# EAGLE design Qwiic_RFID_Tag_X01 (EAGLE 9.6.2)
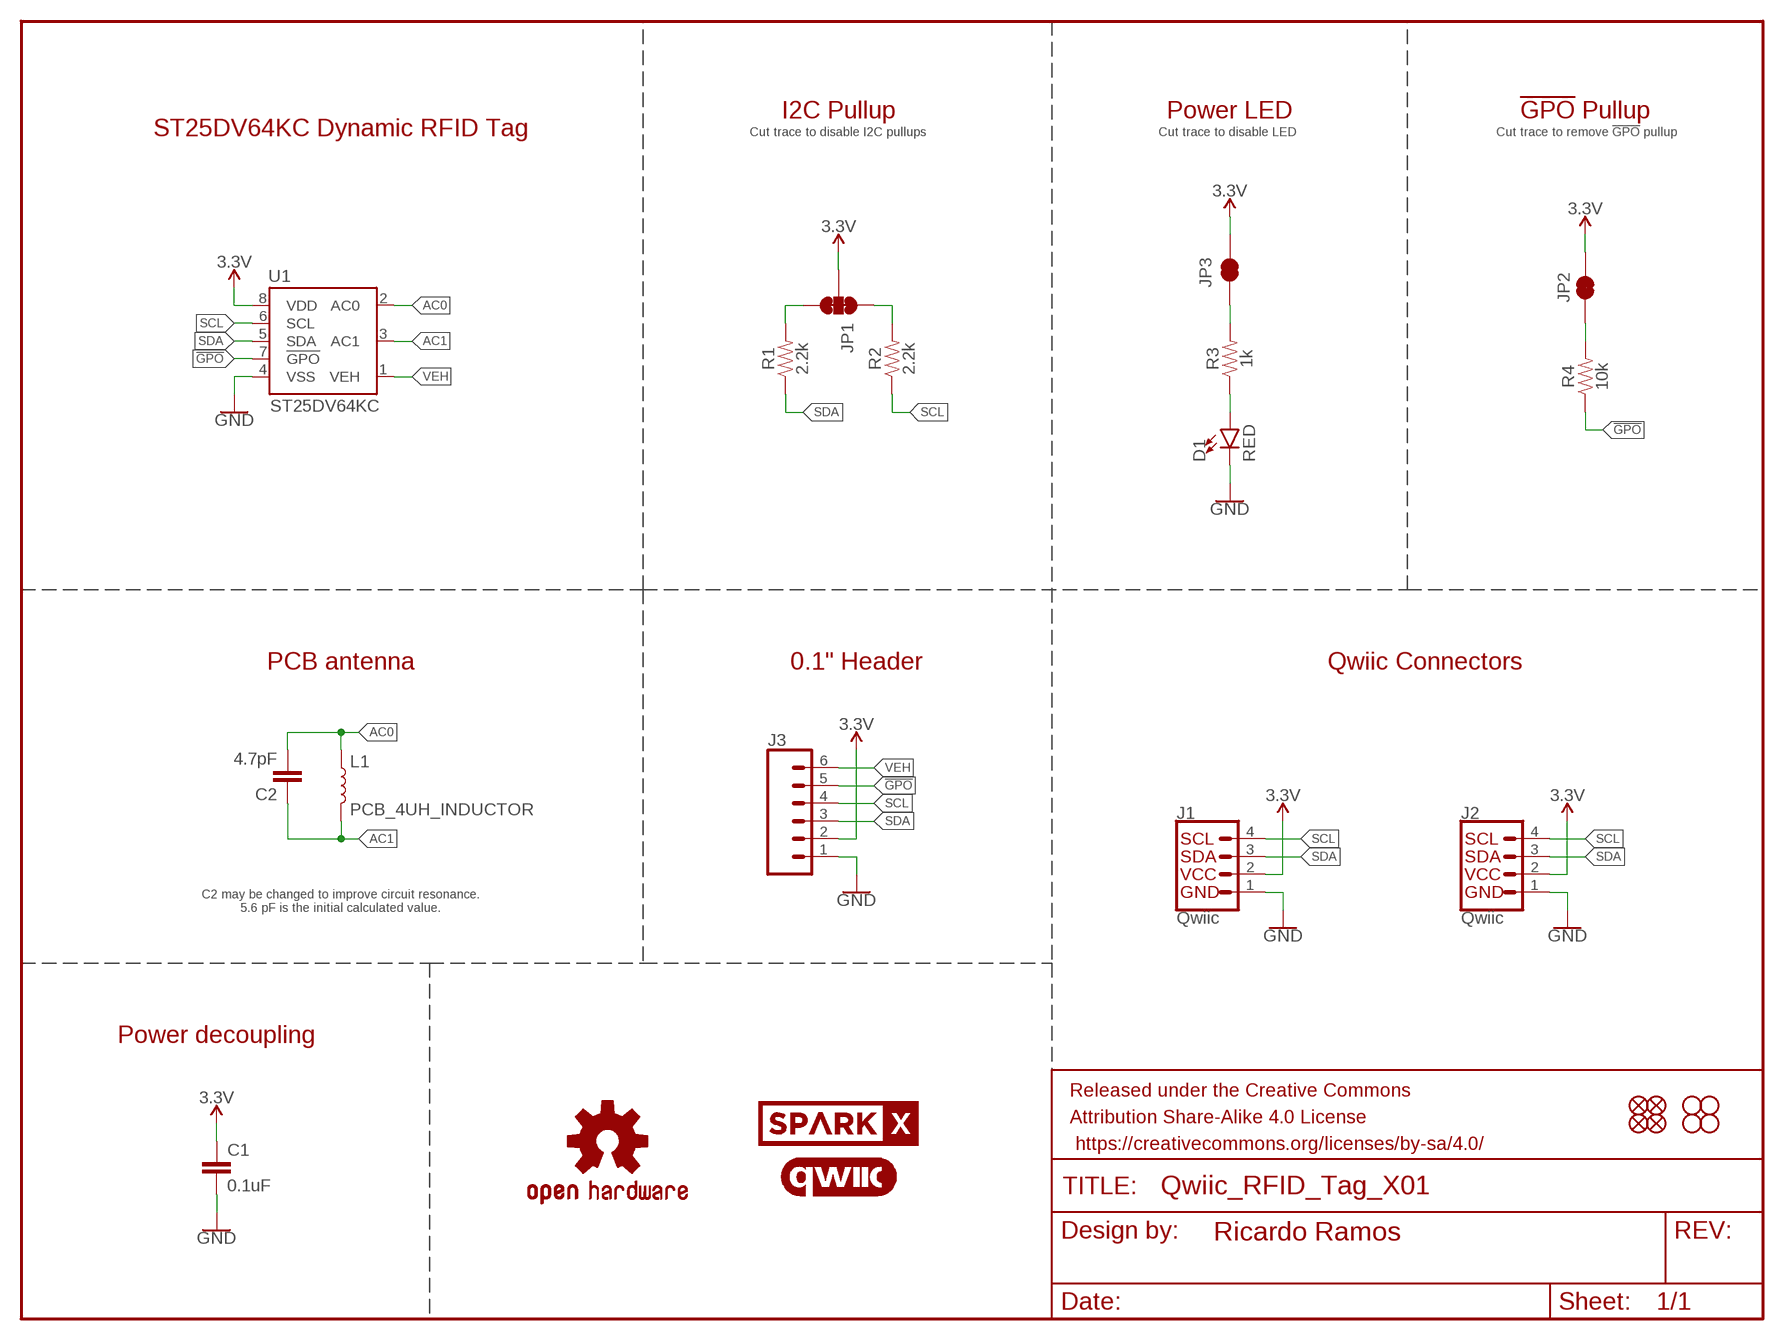
[diagram p0: schematic, sheet 1]

## Parts
C1  0.1uF  0.1UF-0603-25V-(+80/-20%)  [0603]
C2  4.7pF  4.7PF-0603-50V-5%  [0603]
D1  RED  LED-RED0603  [LED-0603]
FD1  FIDUCIAL1X2  [FIDUCIAL-1X2]
FD2  FIDUCIAL1X2  [FIDUCIAL-1X2]
FD3  FIDUCIAL1X2  [FIDUCIAL-1X2]
FD4  FIDUCIAL1X2  [FIDUCIAL-1X2]
FRAME1  FRAME-LETTERNO_PACKAGE  [DUMMY]
H1  STAND-OFF  [STAND-OFF]
H2  STAND-OFF  [STAND-OFF]
H3  STAND-OFF  [STAND-OFF]
H4  STAND-OFF  [STAND-OFF]
J1  Qwiic  QWIIC_CONNECTORJS-1MM  [JST04_1MM_RA]
J2  Qwiic  QWIIC_CONNECTORJS-1MM  [JST04_1MM_RA]
J3  CONN_06NO_SILK_FEMALE_PTH  [1X06_NO_SILK]
JP1  JUMPER-SMT_3_2-NC_TRACE_SILK  [SMT-JUMPER_3_2-NC_TRACE_SILK]
JP2  JUMPER-SMT_2_NC_TRACE_SILK  [SMT-JUMPER_2_NC_TRACE_SILK]
JP3  JUMPER-SMT_2_NC_TRACE_SILK  [SMT-JUMPER_2_NC_TRACE_SILK]
L1  PCB_4UH_INDUCTOR  [PCB_4UH_INDUCTOR]
LOGO1  OSHW-LOGOMINI  [OSHW-LOGO-MINI]
LOGO2  QWIIC_LOGO_7MM  [QWIIC_7MM]
LOGO3  QWIIC_LOGO_7MM  [QWIIC_7MM]
R1  2.2k  2.2KOHM-0603-1/10W-1%  [0603]
R2  2.2k  2.2KOHM-0603-1/10W-1%  [0603]
R3  1k  1KOHM-0603-1/10W-1%  [0603]
R4  10k  10KOHM-0603-1/10W-1%  [0603]
U1  ST25DV64KC  [SO08]
U$1  SPARKX-LOGO5  [SPARKX-LARGE]
U$2  SPARKX-LOGO5  [SPARKX-LARGE]

## Nets
3.3V: C1.1 J1.2 J2.2 J3.2 JP1.2 JP2.2 JP3.2 U1.8(VDD)
!GPO!: J3.5 R4.1 U1.7(!GPO!)
AC0: C2.2 L1.IN1 U1.2(AC0)
AC1: C2.1 L1.IN2 U1.3(AC1)
GND: C1.2 D1.C J1.1 J2.1 J3.1 U1.4(VSS)
N$1: JP3.1 R3.2
N$2: JP1.3 R1.2
N$3: JP1.1 R2.2
N$4: D1.A R3.1
N$5: JP2.1 R4.2
SCL: J1.4 J2.4 J3.4 R2.1 U1.6(SCL)
SDA: J1.3 J2.3 J3.3 R1.1 U1.5(SDA)
VEH: J3.6 U1.1(VEH)

## Notes on the sheet
- I2C Pullup | Power LED | !GPO! Pullup
- ST25DV64KC Dynamic RFID Tag
- Cut trace to disable I2C pullups | Cut trace to disable LED | Cut trace to remove !GPO! pullup
- PCB antenna | 0.1" Header | Qwiic Connectors
- C2 may be changed to improve circuit resonance.
  5.6 pF is the initial calculated value.
- Power decoupling

## Library data of the parts
C1 = SparkFun-Capacitors:0.1UF: 0.1µF ceramic capacitors A capacitor is a passive two-terminal electrical component used to store electrical energy temporarily in an electric field.; PROD_ID: CAP-00810
C2 = SparkFun-Capacitors:4.7PF: 4.7pF ceramic capacitors A capacitor is a passive two-terminal electrical component used to store electrical energy temporarily in an electric field.; PROD_ID: CAP-07880
D1 = SparkFun-LED:LED-RED: Red SMD LED Used in manufacturing of most products at SparkFun Packages: 0603 - SMD 0603 package [Product Link] <http://docs.avagotech.com/docs/AV02-0551EN> 0603 SMART - SMD 0603 SMART package ( more efficient and expensive)[Product Link] <http://www.osram-os.com/Graphics/XPic2/00077099_0.pdf> 1206 - SMD1206 package [Product Link] <https://www.sparkfun.com/datasheets/DevTools/LilyPad/Q150OVS4.pdff> SparkFun Products: Pro Mini 328 -5V <https://www.sparkfun.com/products/821> RedBoard <https://www.sparkfun.com/products/12757> IOIO-OTG <https://www.sparkfun.com/products/13613>; PROD_ID: DIO-00819
FD1-FD4 = SparkFun-Aesthetics:FIDUCIAL: Fiducial Alignment Points Point-of-reference for pick-and-place machines and other optical instruments.
FRAME1 = SparkFun-Aesthetics:FRAME-LETTER: Schematic Frame - Letter Standard 8.5x11 US Letter frame; DESIGNER: Ricardo Ramos; VERSION: v01
H1-H4 = SparkFun-Hardware:STAND-OFF: Stand Off Drill holes for mechanically mounting via screws, standoffs, etc. Note: Use the keepout ring to avoid running the screw head into surrounding components. Variant Overviews STAND-OFF - Mechanical footprint for a #4 phillips button head screw. STAND-OFF-TIGHT - Mechanical footprint for a #4 phillips button head screw, Example SparkFun Products Screw - Phillips Head (1/4", 4-40, 10 pack) <https://www.sparkfun.com/products/10453> (PRT-10453) Screw - Phillips Head (1/2", 4-40, 10 pack) <https://www.sparkfun.com/products/10452> (PRT-10452) Screw - Phillips Head (3/4", 4-40, 10 pack) <https://www.sparkfun.com/products/10451> (PRT-10451) Screw - Phillips Head (1", 4-40, 10 pack) <https://www.sparkfun.com/products/10450> (PRT-10450)
J1 J2 = SparkFun-Connectors:QWIIC_CONNECTOR: SparkFun I2C Standard Qwiic Connector An SMD 1mm pitch JST connector makes it easy and quick (get it? Qwiic?) to connect I2C devices to each other. The Qwiic system <http://www.sparkfun.com/qwiic> enables fast and solderless connection between popular platforms and various sensors and actuators. We carry 200mm <https://www.sparkfun.com/products/14204>, 100mm <https://www.sparkfun.com/products/14205>, 50mm <https://www.sparkfun.com/products/14206>, and breadboard friendly <https://www.sparkfun.com/products/14207> Qwiic cables. We also offer 10 pcs strips <https://www.sparkfun.com/products/14323> the SMD connectors.; PROD_ID: CONN-13694; VALUE: QWIIC_RIGHT_ANGLE
J3 = SparkFun-Connectors:CONN_06: Multi connection point. Often used as Generic Header-pin footprint for 0.1 inch spaced/style header connections On any of the 0.1 inch spaced packages, you can populate with these: Break Away Headers - Straight <https://www.sparkfun.com/products/116> (PRT-00116) Break Away Male Headers - Right Angle <https://www.sparkfun.com/products/553> (PRT-00553) Female Headers <https://www.sparkfun.com/products/115> (PRT-00115) Break Away Headers - Machine Pin <https://www.sparkfun.com/products/117> (PRT-00117) Break Away Female Headers - Swiss Machine Pin <https://www.sparkfun.com/products/743> (PRT-00743) Arduino Stackable Header - 6 Pin <https://www.sparkfun.com/products/9280> (PRT-09280) For SCREWTERMINALS and SPRING TERMINALS visit here: Screw Terimnals on SparkFun.com <https://www.sparkfun.com/search/results?term=Screw+Terminals> (5mm/3.5mm/2.54mm spacing) This device is also useful as a general connection point to wire up your design to another part of your project. Our various solder wires solder well into these plated through hole pads. Hook-Up Wire - Assortment (Stranded, 22 AWG) <https://www.sparkfun.com/products/11375> (PRT-11375) Hook-Up Wire - Assortment (Solid Core, 22 AWG) <https://www.sparkfun.com/products/11367> (PRT-11367) View the entire wire category on our website here <https://www.sparkfun.com/categories/141>; PROD_ID: CONN-08437
JP1 = SparkFun-Jumpers:JUMPER-SMT_3_2-NC_TRACE: Normally closed trace jumper (2 of 2 connections) This jumper has a trace between all three pads so they are normally closed (NC). Use a razor knife to open the connection(s). For best results follow the IPC guidelines for cutting traces: Cutout at least 0.063 mm (0.005 in). Remove all loose material to clean up the cut area. Seal the cut with an approved epoxy. Reapply solder to reclose the connection(s).
JP2 JP3 = SparkFun-Jumpers:JUMPER-SMT_2_NC_TRACE: Normally closed trace jumper This jumper has a trace between two pads so it's normally closed (NC). Use a razor knife to open the connection. For best results follow the IPC guidelines for cutting traces: Cutout at least 0.063 mm (0.005 in). Remove all loose material to clean up the cut area. Seal the cut with an approved epoxy. Reapply solder to reclose the connection.
L1 = SparkFun-Coils:PCB_4UH_INDUCTOR
LOGO1 = SparkFun-Aesthetics:OSHW-LOGO: Open-Source Hardware (OSHW) Logo This logo indicates the piece of hardware it is found on incorporates a OSHW license and/or adheres to the definition of open source hardware found here: http://freedomdefined.org/OSHW
LOGO2 LOGO3 = SparkFun-Aesthetics:QWIIC_LOGO: Qwiic Logos for placement on schematic and PCB. The 5.5mm silk logo is best for placing next to Qwiic connector.
R1 R2 = SparkFun-Resistors:2.2KOHM: 2.2kΩ resistor A resistor is a passive two-terminal electrical component that implements electrical resistance as a circuit element. Resistors act to reduce current flow, and, at the same time, act to lower voltage levels within circuits. - Wikipedia; PROD_ID: RES-08272
R3 = SparkFun-Resistors:1KOHM: 1kΩ resistor A resistor is a passive two-terminal electrical component that implements electrical resistance as a circuit element. Resistors act to reduce current flow, and, at the same time, act to lower voltage levels within circuits. - Wikipedia; PROD_ID: RES-07856
R4 = SparkFun-Resistors:10KOHM: 10kΩ resistor A resistor is a passive two-terminal electrical component that implements electrical resistance as a circuit element. Resistors act to reduce current flow, and, at the same time, act to lower voltage levels within circuits. - Wikipedia; PROD_ID: RES-00824
U1 = SparkFun-RF:ST25DV64KC: Dynamic NFC/RFID Dynamic NFC/RFID tag IC with 4-Kbit, 16-Kbit or 64-Kbit EEPROM, fast transfer mode capability and optimized I2C.; PROD_ID: IC-16315
U$1 U$2 = SparkX:SPARKX-LOGO

## Board
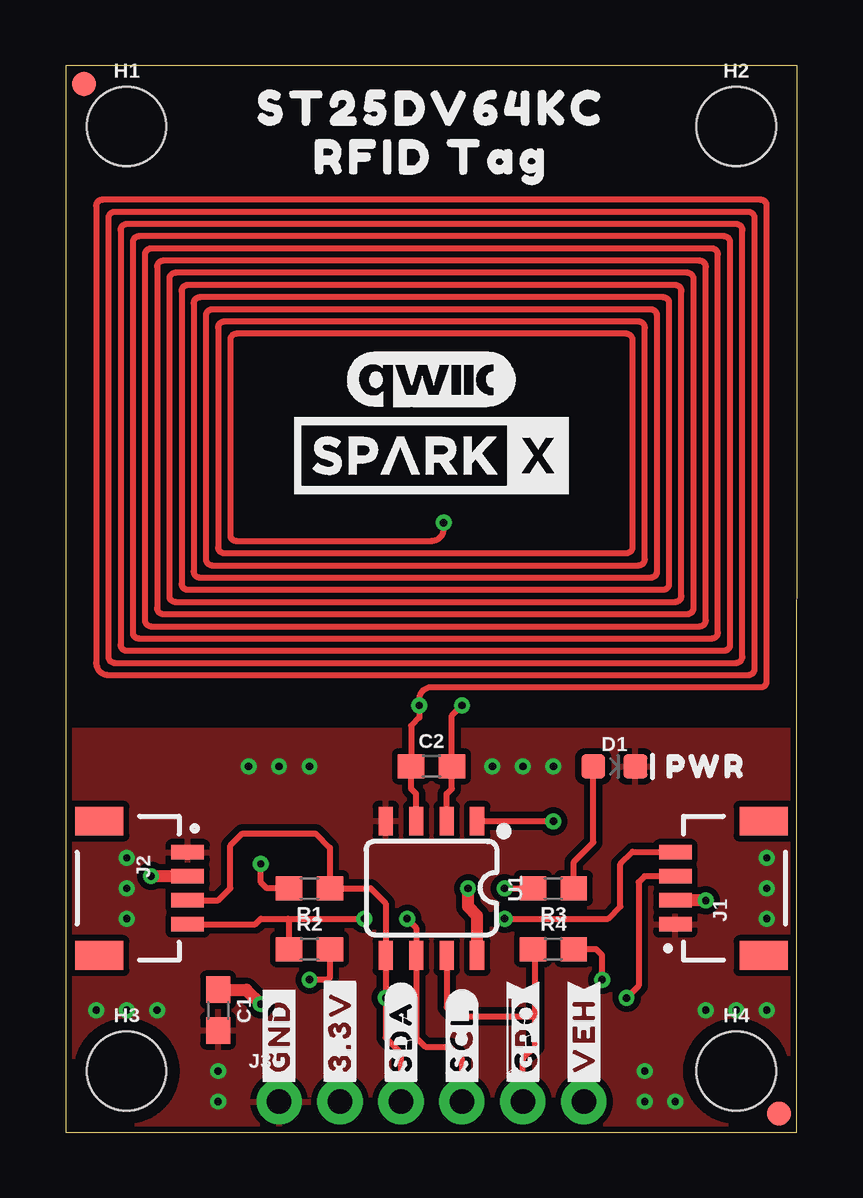
[diagram p1: board, top side]
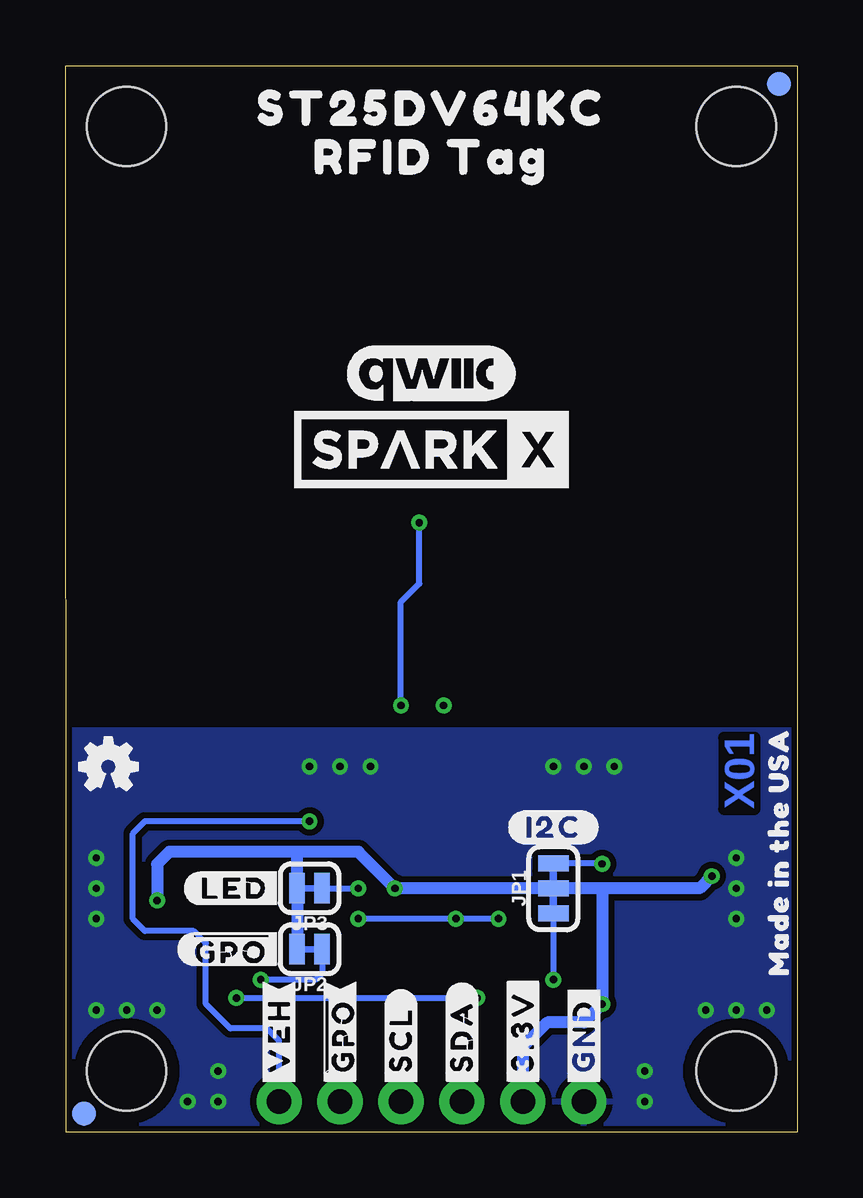
[diagram p2: board, bottom side, seen from below]

Size 30.48 x 44.45 mm. Coordinates in mm from the lower left corner, seen from the top.
Outline: 0,0 30.46,0 30.48,44.45 0,44.45 0,0
Copper layers (1*16): Top 0.035mm / dielectric 1.5mm / Bottom 0.035mm
Design rules "SparkFun-2-Layer-General-JLCPCB": minimum track width 7mil, minimum drill 0.3mm, track to track 7mil, track to pad 7mil, pad to pad 7mil, via to via 7mil, smd to smd 7mil, copper to edge 7mil, drill to drill 7mil, minimum pad ring 7mil, minimum via ring 7mil, stop-mask expansion 4mil, vias tented up to drill 25mil, thermal gap 10mil

### Footprints (pad centres in the part's own frame; a part is rotated, then mirrored left to right if it is on the bottom)
0603 = smd 1.1 x 1: 1 -0.85,0; 2 0.85,0
LED-0603 = smd 1 x 1: A -0.877,0; C 0.877,0
FIDUCIAL-1X2 = smd 1 x 1: 1 0,0
STAND-OFF = hole 3.302: 0,0
JST04_1MM_RA = smd 0.6 x 1.35: 1 -1.5,0; 2 -0.5,0; 3 0.5,0; 4 1.5,0 | smd 1.2 x 2: NC1 2.8,-3.675; NC2 -2.8,-3.675
1X06_NO_SILK = drill 1.016 pad 1.88: 1 0,0; 2 2.54,0; 3 5.08,0; 4 7.62,0; 5 10.16,0; 6 12.7,0
SMT-JUMPER_3_2-NC_TRACE_SILK = smd 0.66 x 1.27: 1 -1.041,0; 2 0,0; 3 1.041,0
SMT-JUMPER_2_NC_TRACE_SILK = smd 0.66 x 1.27: 1 -0.521,0; 2 0.521,0
PCB_4UH_INDUCTOR = drill 0.305 pad 0.61: IN1 0.508,7.62; IN2 -0.508,0
SO08 = smd 0.6 x 1.2: 1 -1.905,-2.8; 2 -0.635,-2.8; 3 0.635,-2.8; 4 1.905,-2.8; 5 1.905,2.8; 6 0.635,2.8; 7 -0.635,2.8; 8 -1.905,2.8

### Placement (x,y rotation side)
C1  6.35,5.08 270 top
C2  15.24,15.24 0 top
D1  22.86,15.24 0 top
FD1  0.76,43.69 0 bottom
FD2  0.76,43.69 0 top
FD3  29.72,0.76 0 bottom
FD4  29.72,0.76 0 top
FRAME1  0,0 0 top
H1  2.54,41.91 0 top
H2  27.94,41.91 0 top
H3  2.54,2.54 0 top
H4  27.94,2.54 0 top
J1  25.4,10.16 90 top
J2  5.08,10.16 270 top
J3  8.89,1.27 0 top
JP1  10.16,10.16 90 bottom
JP2  20.32,7.62 180 bottom
JP3  20.32,10.16 180 bottom
L1  15.24,17.78 0 top
LOGO1  28.7,15.24 0 bottom
LOGO2  15.24,31.62 0 bottom
LOGO3  15.24,31.37 0 top
R1  10.16,10.16 180 top
R2  10.16,7.62 0 top
R3  20.32,10.16 180 top
R4  20.32,7.62 0 top
U1  15.24,10.16 180 top
U$1  15.24,28.19 0 top
U$2  15.24,28.45 0 bottom
U$3  [#3#3V#0]  11.43,1.78 90 top
U$4  [#GND#4]  8.89,1.78 90 top
U$5  [#SDA#5]  13.97,1.78 90 top
U$6  [#SCL#6]  16.51,1.78 90 top
U$7  [##GPO##8]  19.05,1.78 90 top
U$8  [#VEH#7]  21.59,1.78 90 top
U$9  [PWR11]  26.67,15.24 0 top
U$11  [RFID_TAG13]  15.24,40.64 0 top
U$12  [RFID_TAG13]  15.24,40.64 0 bottom
U$13  [ST25DV64KC5984]  15.24,42.67 0 top
U$15  [#I2C#11]  10.16,12.7 0 bottom
U$16  [##GPO##9]  21.34,7.62 0 bottom
U$17  [#LED#10]  21.34,10.16 0 bottom
U$18  [#GND#4]  8.89,1.78 90 bottom
U$19  [#3#3V#0]  11.43,1.78 90 bottom
U$20  [#SDA#5]  13.97,1.78 90 bottom
U$21  [#SCL#6]  16.51,1.78 90 bottom
U$22  [##GPO##8]  19.05,1.78 90 bottom
U$23  [#VEH#7]  21.59,1.78 90 bottom
U$24  [ST25DV64KC5984]  15.24,42.67 0 bottom
U$34  [MADE_IN_THE_USA20]  0.76,11.68 90 bottom

### Tracks (layer width: path | path; a pad name or v marks a point on that pad's centre or on a via)
3.3V  (via drill 0.3)
  Top 0.508: J2.2 v3.56,10.66 v3.56,10.67 | v26.67,9.65 J1.2 | U1.8 17.14,9.02 16.76,9.4 v16.76,10.16 | C1.1 7.53,5.93 v8.13,5.33
  Bottom 0.508: v3.56,10.67 4.06,10.16 8.13,10.16 | 8.13,10.16 JP1.2 v16.76,10.16 18.29,11.68 20.83,11.68 | 20.83,11.68 26.16,11.68 26.67,11.18 v26.67,9.65 | 20.83,11.68 20.83,10.17 JP3.2 JP2.2 | 8.13,10.16 v8.13,5.33 8.89,4.57 10.41,4.57 11.43,3.56 J3.2
!GPO!
  Top 0.254: U1.7 15.88,5.21 16.26,4.83 19.56,4.83 | J3.5 19.05,3.05 19.56,3.56 19.56,4.83 | 19.56,4.83 19.56,7.53 R4.1
AC0  (via drill 0.3)
  Top 0.254: U1.2 15.88,14.1 16.09,14.31 C2.2 16.09,17.36 v16.51,17.78
  Bottom 0.254: v16.51,17.78 16.51,22.1 15.75,22.86 L1.IN1
AC1
  Top 0.254: L1.IN2 14.73,17.27 14.39,16.93 C2.1 14.39,14.31 14.61,14.1 U1.3
GND  (via drill 0.3)
  other vias: 2.54,11.43 2.54,10.16 2.54,8.89 6.35,2.54 6.35,1.27 7.62,15.24 8.89,15.24 10.16,15.24 17.78,15.24 19.05,15.24 20.32,15.24 24.13,1.27 25.4,1.27 24.13,2.54 29.21,11.43 29.21,10.16 29.21,8.89 26.67,5.08 29.21,5.08 27.94,5.08 1.27,5.08 3.81,5.08 2.54,5.08
  pour Top (isolate 0.254): 0,0 0,16.76 30.48,16.76 30.48,0
  pour Bottom (isolate 0.254): 0,16.76 30.48,16.76 30.48,0 0,0
N$1  (via drill 0.3)
  Top 0.254: v18.29,10.16 R3.2
  Bottom 0.254: JP3.1 v18.29,10.16
N$2  (via drill 0.3)
  Top 0.254: R1.2 8.38,10.16 8.13,10.41 v8.13,11.18
  Bottom 0.254: v8.13,11.18 8.15,11.2 JP1.3
N$3  (via drill 0.3)
  Top 0.254: R2.2 11.01,6.44 10.92,6.35 v10.16,6.35
  Bottom 0.254: JP1.1 v10.16,6.35
N$4
  Top 0.254: R3.1 21.17,11.26 21.98,12.08 D1.A
N$5  (via drill 0.3)
  Top 0.254: v22.35,6.35 22.35,7.37 22.1,7.62 R4.2
  Bottom 0.254: JP2.1 19.8,6.62 20.07,6.35 v22.35,6.35
SCL  (via drill 0.3)
  Top 0.254: J3.4 16.51,3.05 16,3.56 14.99,3.56 14.61,3.94 U1.6 14.61,8.51 v14.22,8.89 | v18.29,8.89 22.61,8.89 23.11,9.4 23.11,11.18 23.62,11.68 25.38,11.68 J1.4 | J2.4 7.9,8.66 8.13,8.89 9.27,8.89 | 9.27,8.89 v12.45,8.89 | R2.1 9.31,8.85 9.27,8.89
  Bottom 0.254: v12.45,8.89 v14.22,8.89 v18.29,8.89
SDA  (via drill 0.3)
  Top 0.254: J3.3 13.97,3.3 13.34,3.94 v13.34,5.59 U1.5 13.34,9.53 12.7,10.16 R1.1 11.01,11.85 10.41,12.45 7.37,12.45 6.86,11.94 6.86,10.16 6.36,9.66 J2.3 | J1.3 24.12,10.66 23.88,10.41 23.88,6.1 v23.37,5.59
  Bottom 0.254: v23.37,5.59 v13.34,5.59
VEH  (via drill 0.3)
  Top 0.254: U1.1 v20.31,12.96 v20.32,12.95
  Bottom 0.254: v20.32,12.95 27.18,12.95 27.69,12.45 27.69,8.89 27.18,8.38 25.15,8.38 24.64,7.87 24.64,5.33 23.62,4.32 22.1,4.32 21.59,3.81 J3.6

### Text on the board
Bottom: X01
Measures: Dimensions in inches